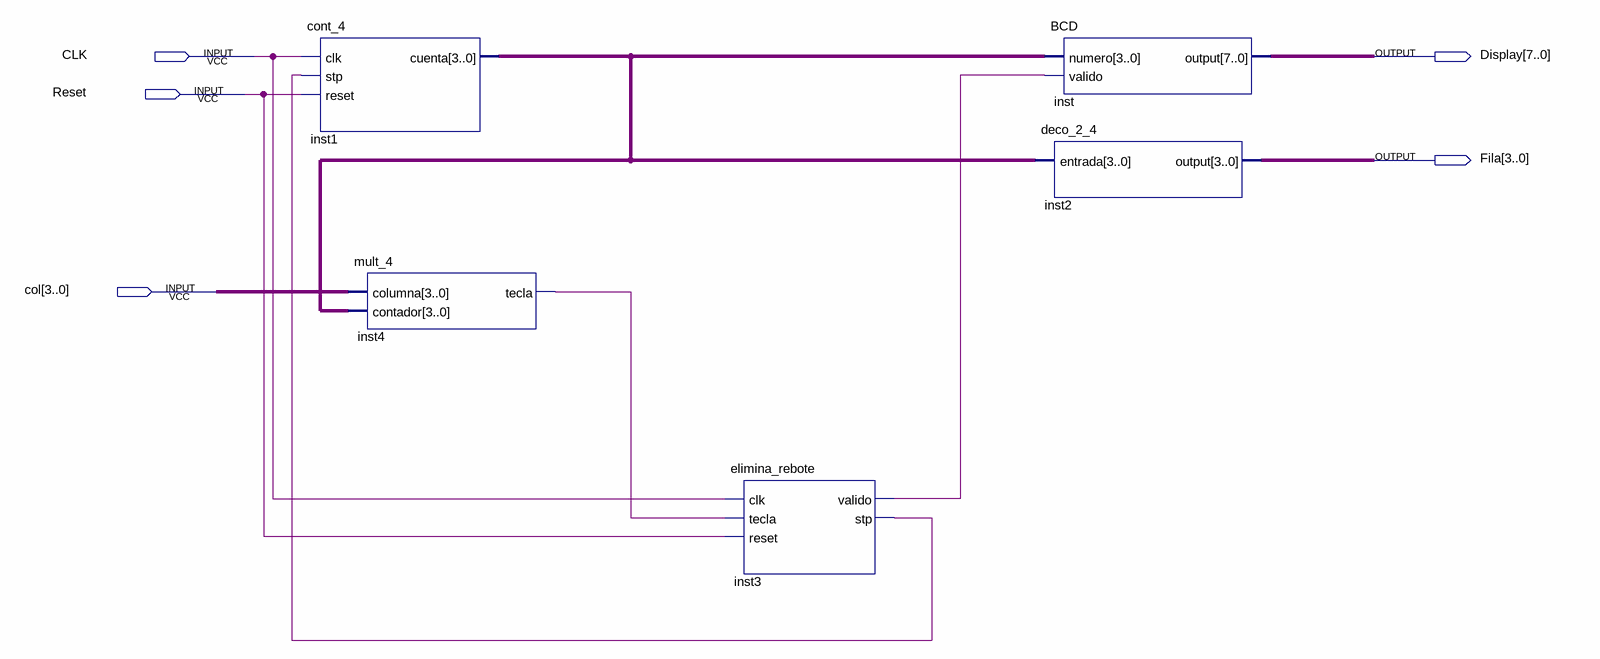
[diagram p0: schematic sheet]
// Quartus schematic Block1.bdf as structural Verilog: 5 symbols, 5 pins
module Block1 (
  input  CLK,
  input  Reset,
  input  [3:0] col,
  output [7:0] Display,
  output [3:0] Fila
);

  wire inst3_stp, inst3_valido, inst4_tecla;
  wire [3:0] inst1_cuenta;

  cont_4 inst1 (.clk(CLK), .stp(inst3_stp), .reset(Reset), .cuenta(inst1_cuenta));
  mult_4 inst4 (.columna(col), .contador(inst1_cuenta), .tecla(inst4_tecla));
  elimina_rebote inst3 (.clk(CLK), .tecla(inst4_tecla), .reset(Reset), .valido(inst3_valido), .stp(inst3_stp));
  BCD inst (.numero(inst1_cuenta), .valido(inst3_valido), .\output (Display));
  deco_2_4 inst2 (.entrada(inst1_cuenta), .\output (Fila));
endmodule
